# EAGLE design open-lux-L (EAGLE 6.5.0)
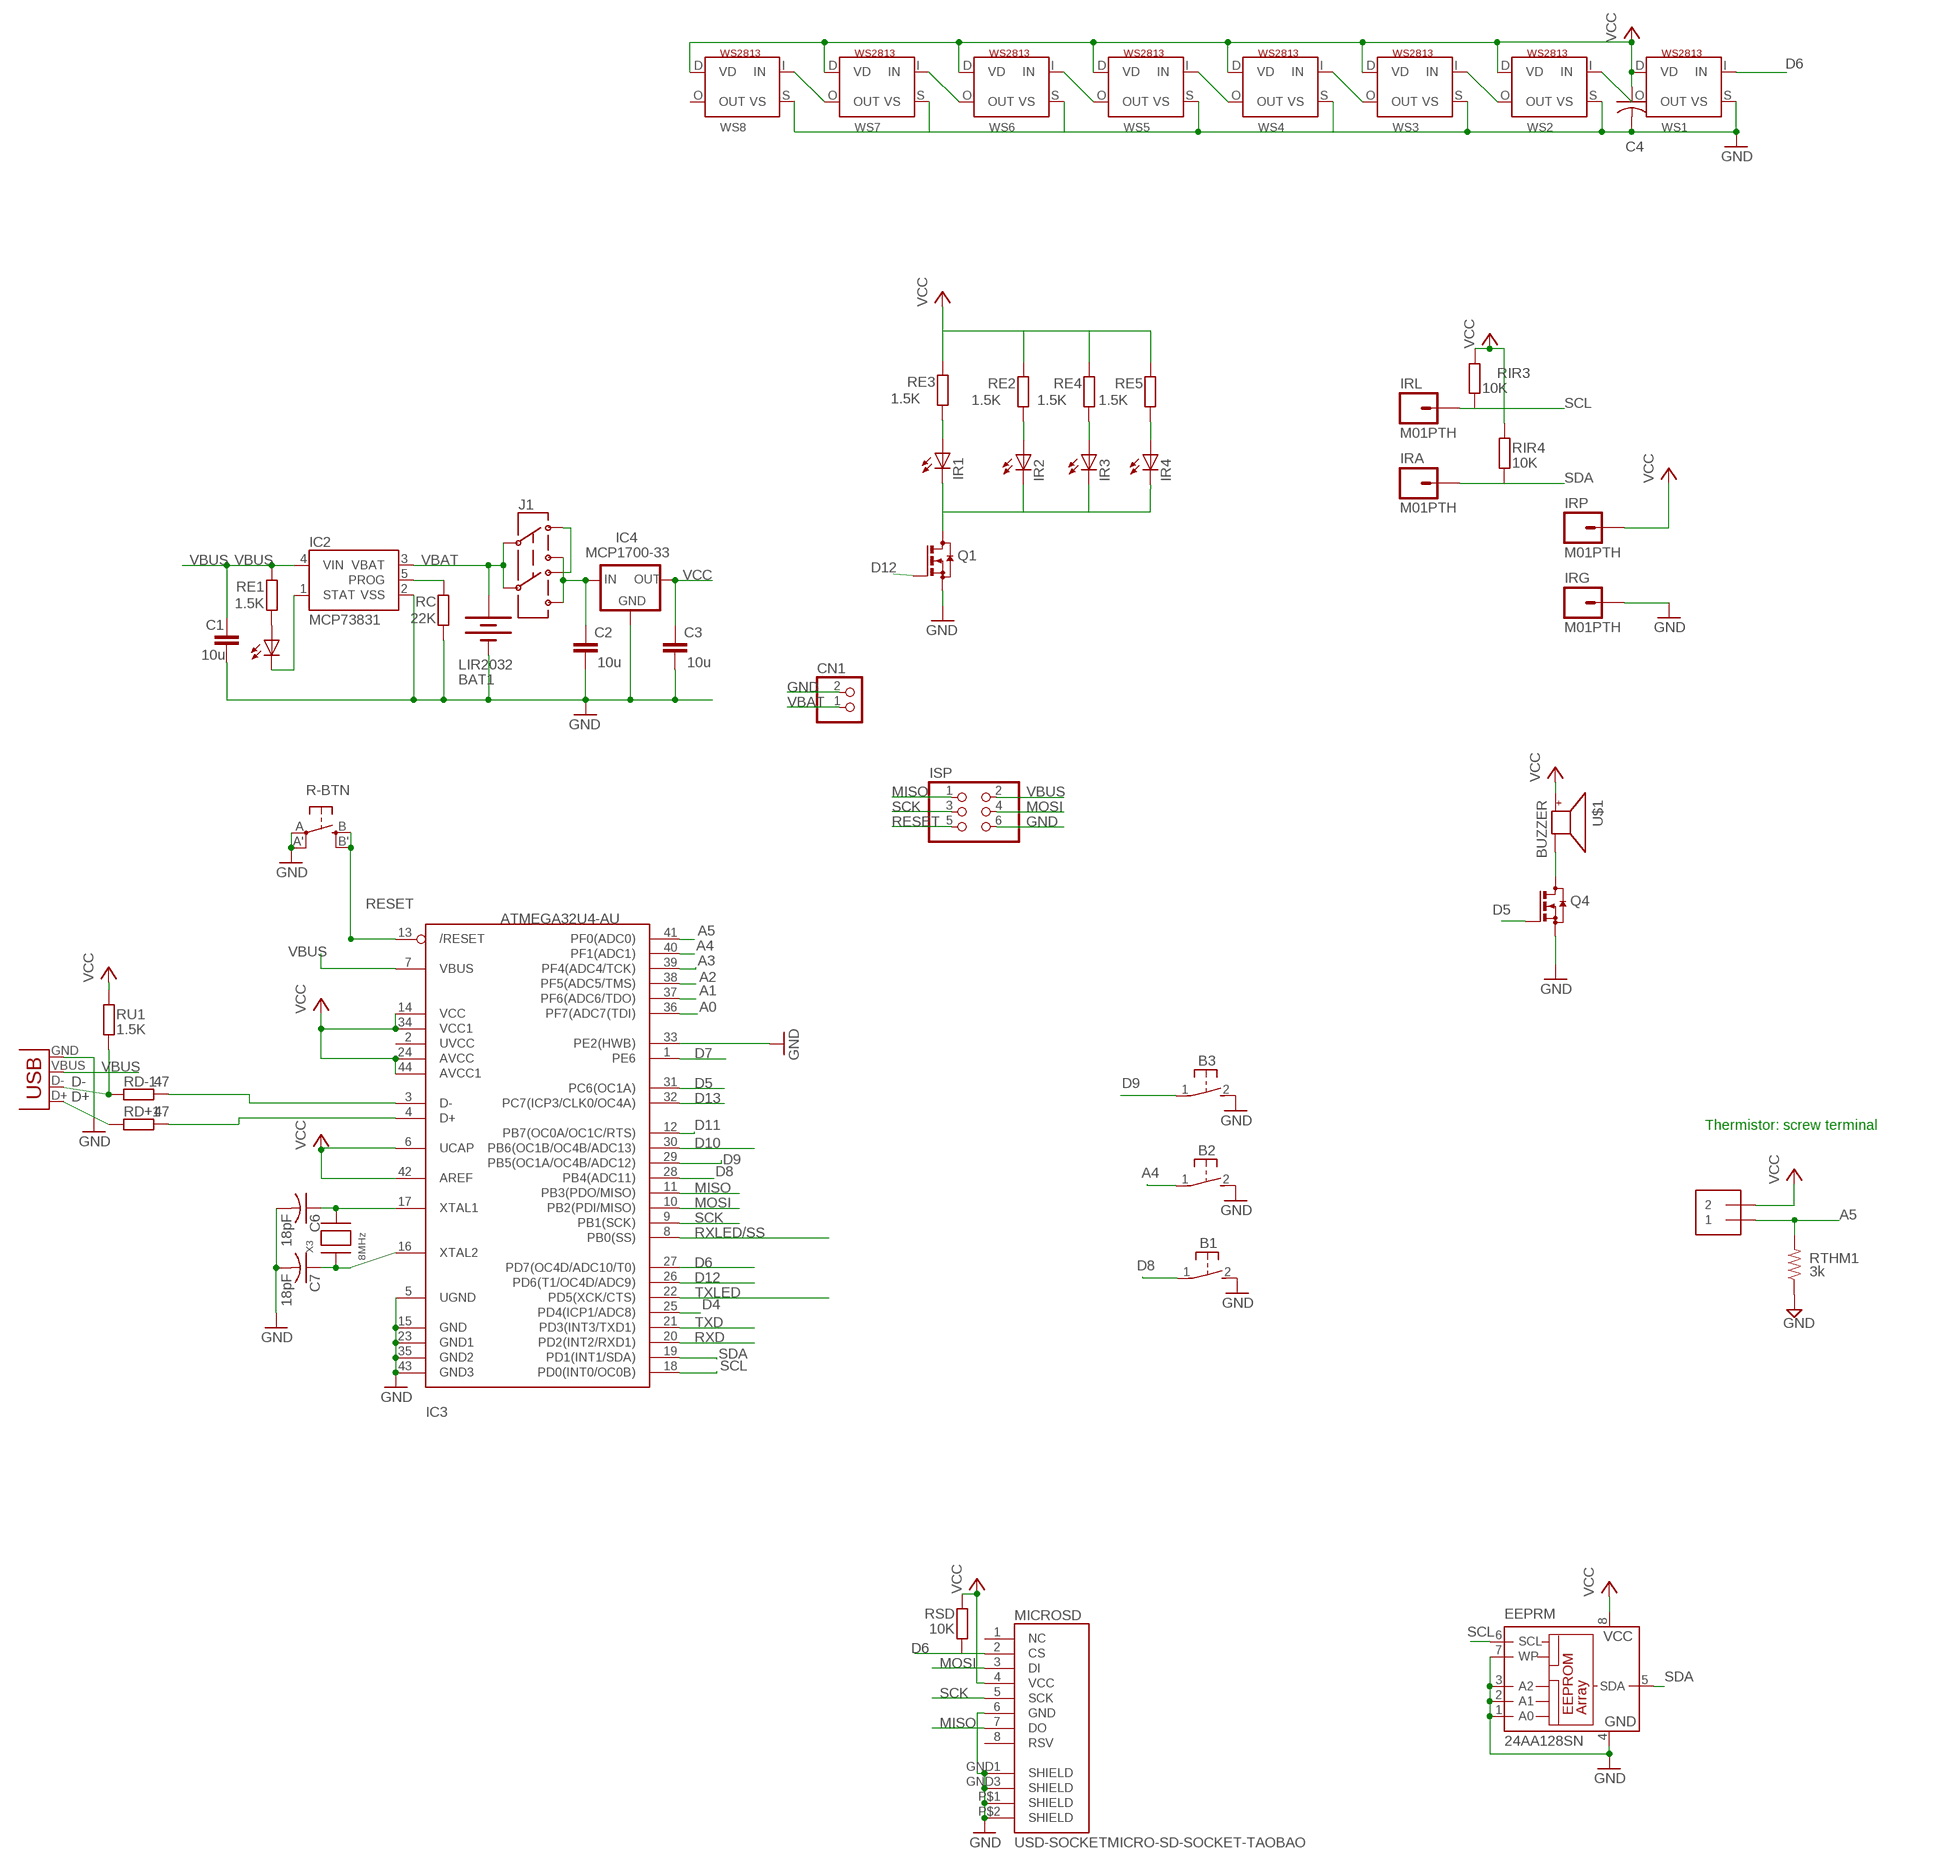
[diagram p0: schematic, sheet 1, part 1 of 2]
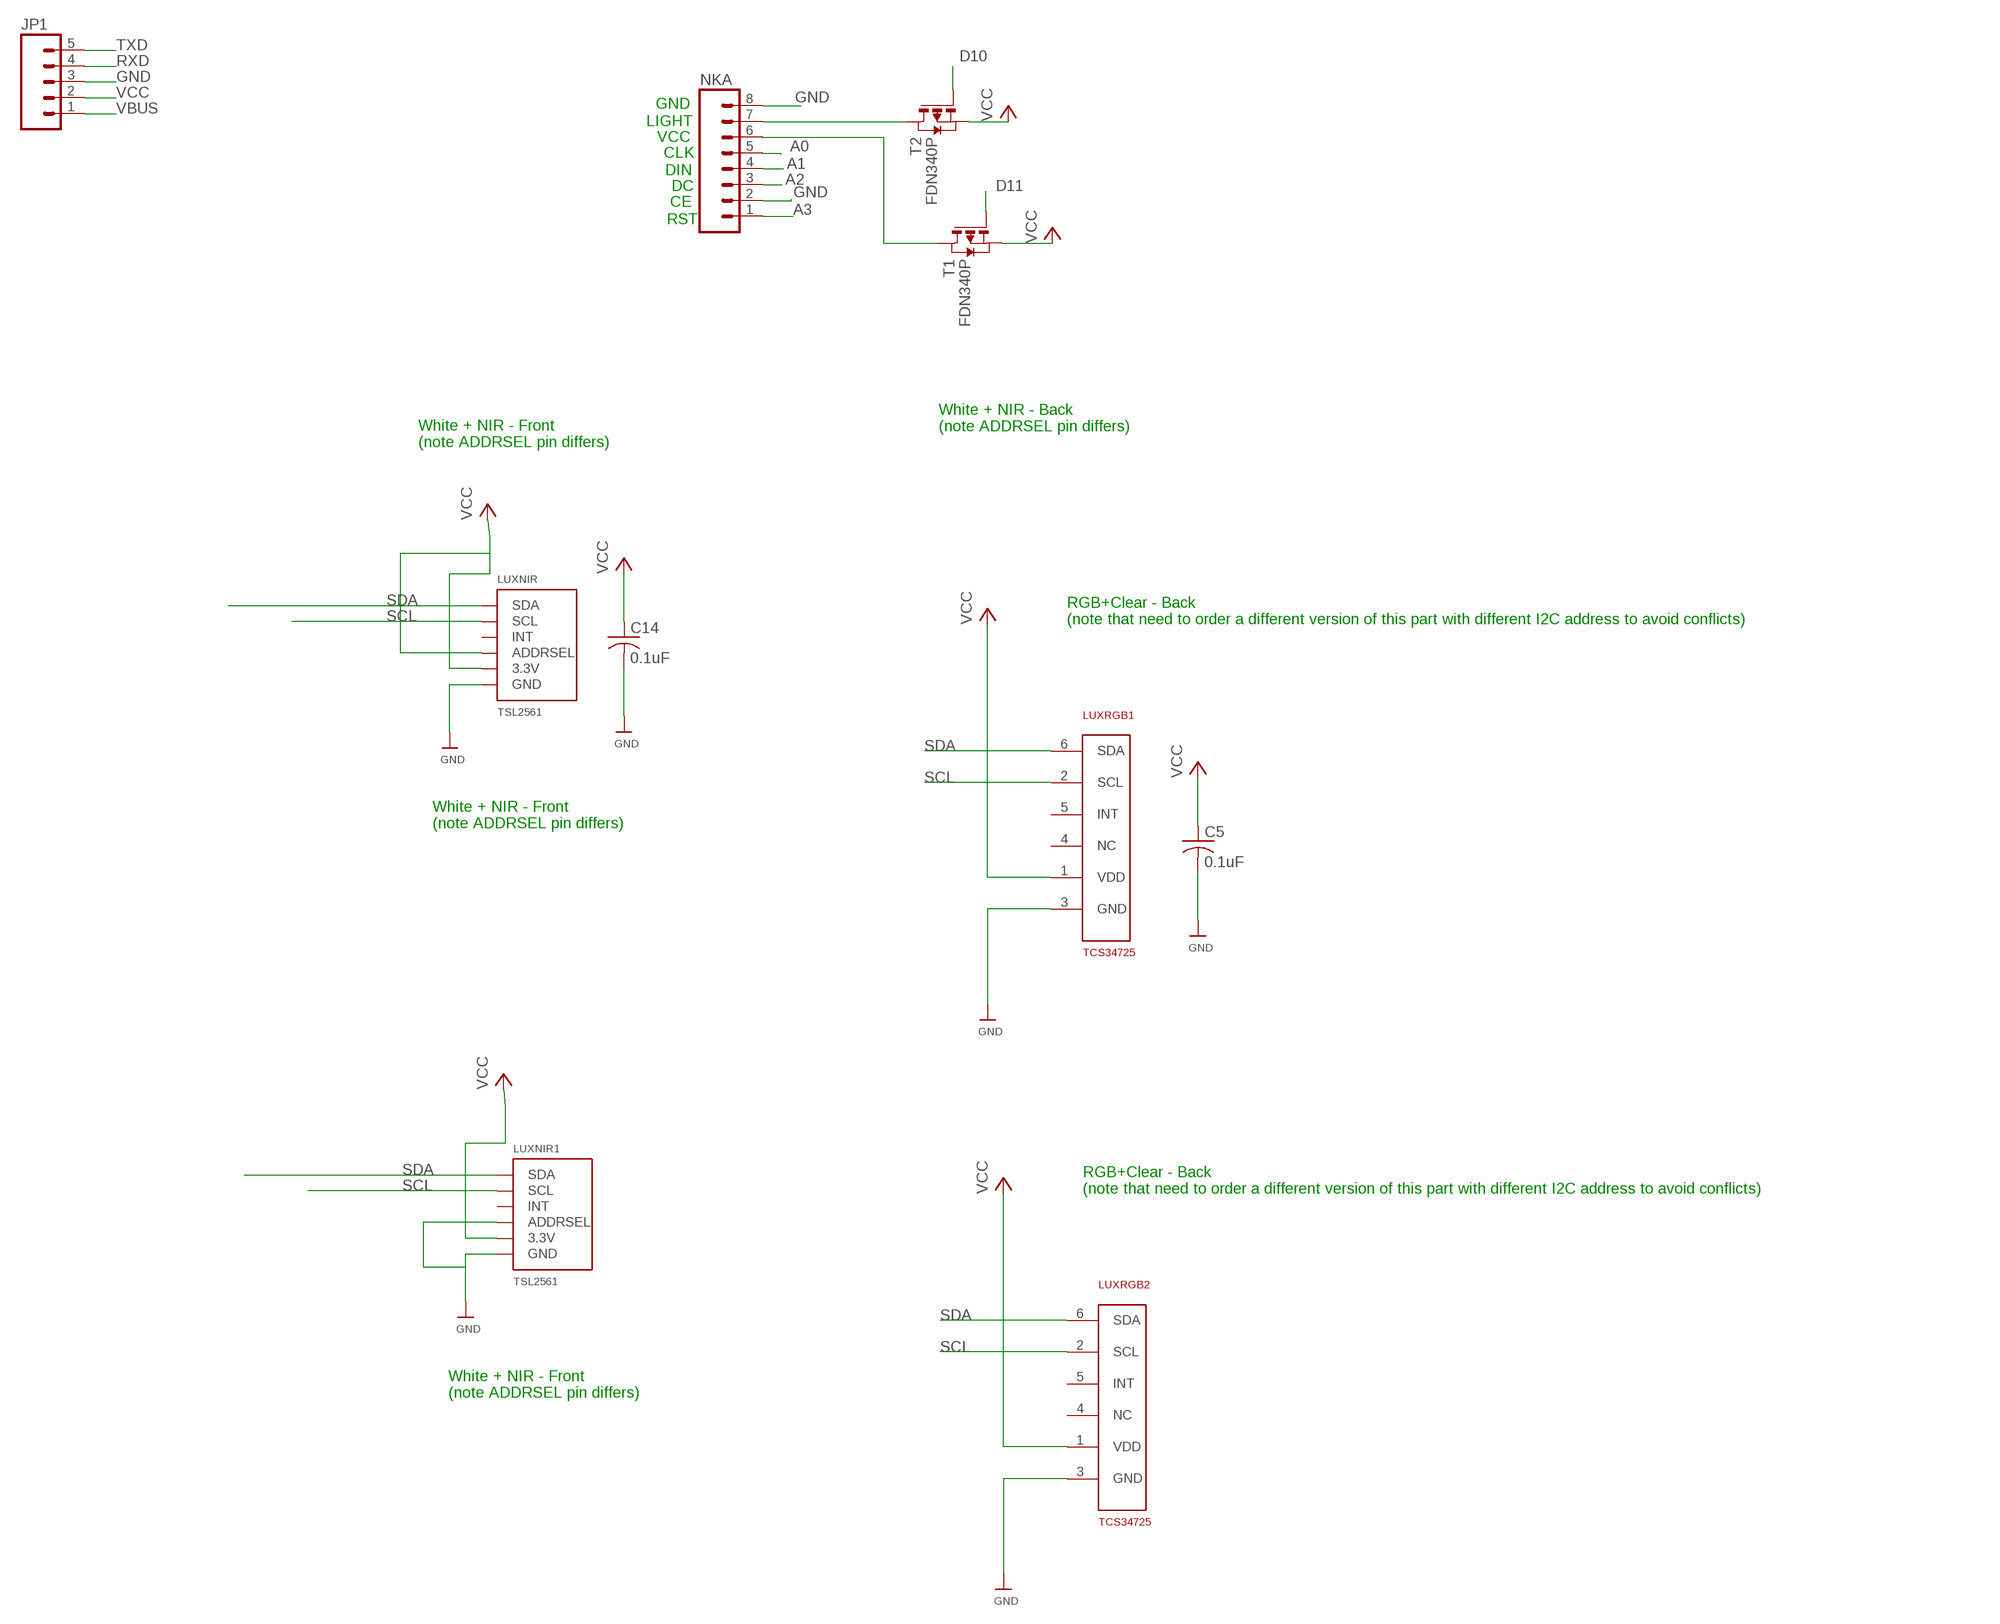
[diagram p1: schematic, sheet 1, part 2 of 2]

## Parts
B1  31-XX  [B3F-31XX]
B2  31-XX  [B3F-31XX]
B3  31-XX  [B3F-31XX]
BAT1  LIR2032  BATTERYBATTCOM_20MM_PTH_SMT  [BATTCOM_20MM_PTH_SMT]
C1  10u  C-EUC0805  [C0805]
C2  10u  C-EUC0805  [C0805]
C3  10u  C-EUC0805  [C0805]
C4  C-USC0805K  [C0805K]
C5  0.1uF  C-USC0805  [C0805]
C6  18pF  C-USC0805K  [C0805K]
C7  18pF  C-USC0805K  [C0805K]
C14  0.1uF  C-USC0805  [C0805]
CHARGE  0805  LEDCHIPLED_0805  [CHIPLED_0805]
CN1  JST_2PIN-SMT-RA  [JST-PH-2-SMT-RA]
EEPRM  24AA128SN  [SO-08]
IC2  MCP73831  [SOT23-5]
IC3  ATMEGA32U4-AU  [TQFP44]
IC4  MCP1700-33  MCP1700SOT233  [SOT23]
IR1  LEDCHIP-LED0603  [CHIP-LED0603]
IR2  LEDCHIP-LED0603  [CHIP-LED0603]
IR3  LEDCHIP-LED0603  [CHIP-LED0603]
IR4  LEDCHIP-LED0603  [CHIP-LED0603]
IRA  M01PTH  [1X01]
IRG  M01PTH  [1X01]
IRL  M01PTH  [1X01]
IRP  M01PTH  [1X01]
ISP  PINHD-2X3  [2X03]
J1  AYZ0202  [AYZ0202]
JP1  M05LOCK  [1X05_LOCK]
LUXNIR  TSL2561  [TSL2561_FN@1]
LUXNIR1  TSL2561  [TSL2561_FN@1]
LUXRGB1  TCS34725  [DFN-6]
LUXRGB2  TCS34725  [DFN-6]
MICROSD  USD-SOCKETMICRO-SD-SOCKET-TAOBAO  [MICRO-SD-SOCKET-TAOBAO]
NKA  M08LOCK  [1X08_LOCK]
Q1  BSS123  [SOT23]
Q4  BSS123  [SOT23]
R-BTN  EVQQ2  [EVQ-Q2]
RC  22K  R-EU_R0805  [R0805]
RD+1  47  R-EU_R0805  [R0805]
RD-1  47  R-EU_R0805  [R0805]
RE1  1.5K  R-EU_R0805  [R0805]
RE2  1.5K  R-EU_R0805  [R0805]
RE3  1.5K  R-EU_R0805  [R0805]
RE4  1.5K  R-EU_R0805  [R0805]
RE5  1.5K  R-EU_R0805  [R0805]
RIR3  10K  R-EU_R0805  [R0805]
RIR4  10K  R-EU_R0805  [R0805]
RSD  10K  R-EU_R0805  [R0805]
RTHM1  3k  R-US_R0805  [R0805@1]
RU1  1.5K  R-EU_R0805  [R0805]
T1  FDN340P  PMOSSOT23  [SOT-23]
T2  FDN340P  PMOSSOT23  [SOT-23]
THM1  1X2-3.5MM  [1X2-3.5MM]
U$1  BUZZER  [SMT-8585-BUZZER]
WS1  WS2813  [RGBLED5050_4]
WS2  WS2813  [RGBLED5050_4]
WS3  WS2813  [RGBLED5050_4]
WS4  WS2813  [RGBLED5050_4]
WS5  WS2813  [RGBLED5050_4]
WS6  WS2813  [RGBLED5050_4]
WS7  WS2813  [RGBLED5050_4]
WS8  WS2813  [RGBLED5050_4]
X2  USBSMD  [USB-MINIB]
X3  8MHz  XTALNX5032  [NX5032]

## Nets
A0: IC3.36(PF7(ADC7(TDI)) NKA.5
A1: IC3.37(PF6(ADC6/TDO)) NKA.4
A2: IC3.38(PF5(ADC5/TMS)) NKA.3
A3: IC3.39(PF4(ADC4/TCK)) NKA.1
A4: B2.1(P) IC3.40(PF1(ADC1))
A5: IC3.41(PF0(ADC0)) RTHM1.2 THM1.1
D4: IC3.25(PD4(ICP1/ADC8))
D5: IC3.31(PC6(OC1A)) Q4.1(G)
D6: IC3.27(PD7(OC4D/ADC10/T0)) MICROSD.2(CS) RSD.1 WS1.I(IN)
D7: IC3.1(PE6)
D8: B1.1(P) IC3.28(PB4(ADC11))
D9: B3.1(P) IC3.29(PB5(OC1A/OC4B/ADC12))
D10: IC3.30(PB6(OC1B/OC4B/ADC13)) T2.3(G)
D11: IC3.12(PB7(OC0A/OC1C/RTS)) T1.3(G)
D12: IC3.26(PD6(T1/OC4D/ADC9)) Q1.1(G)
D13: IC3.32(PC7(ICP3/CLK0/OC4A))
D+: RD+1.1 X2.D+
D-: RD-1.1 RU1.1 X2.D-
GND: B1.2(S) B2.2(S) B3.2(S) BAT1.P$1(-) C1.2 C2.2 C3.2 C4.2 C5.2 C6.2 C7.2 C14.2 CN1.2 EEPRM.1(A0) EEPRM.2(A1) EEPRM.3(A2) EEPRM.4(GND) EEPRM.7(WP) IC2.2(VSS) IC3.5(UGND) IC3.15(GND) IC3.23(GND1) IC3.33(PE2(HWB)) IC3.35(GND2) IC3.43(GND3) IC4.1(GND) IRG.1 ISP.6 JP1.3 LUXNIR1.ADR(ADDRSEL) LUXNIR1.VSS(GND) LUXNIR.VSS(GND) LUXRGB1.3(GND) LUXRGB2.3(GND) MICROSD.6(GND) MICROSD.GND1(SHIELD) MICROSD.GND3(SHIELD) MICROSD.P$1(SHIELD) MICROSD.P$2(SHIELD) NKA.2 NKA.8 Q1.2(S) Q4.2(S) R-BTN.A'(P1) R-BTN.A(P) RC.1 RTHM1.1 WS1.S(VS) WS2.S(VS) WS3.S(VS) WS4.S(VS) X2.GND
GND1: WS6.S(VS)
GND2: WS5.S(VS)
MISO: IC3.11(PB3(PDO/MISO)) ISP.1 MICROSD.7(DO)
MOSI: IC3.10(PB2(PDI/MISO)) ISP.4 MICROSD.3(DI)
N$1: J1.3 J1.6
N$2: C7.1 IC3.16(XTAL2) X3.P$1
N$3: C6.1 IC3.17(XTAL1) X3.P$2
N$4: NKA.7 T2.1(D)
N$5: CHARGE.C IC2.1(STAT)
N$6: IC2.5(PROG) RC.2
N$7: Q4.3(D) U$1.-
N$8: NKA.6 T1.1(D)
N$9: IR1.C IR2.C IR3.C IR4.C Q1.3(D)
N$10: CHARGE.A RE1.1
N$11: IR1.A RE3.1
N$13: IR2.A RE2.1
N$14: WS6.O(OUT) WS7.I(IN)
N$15: IR3.A RE4.1
N$16: WS7.S(VS) WS8.S(VS)
N$17: IR4.A RE5.1
N$19: WS5.I(IN)
N$20: WS5.O(OUT) WS6.I(IN)
N$21: IC3.4(D+) RD+1.2
N$22: IC3.3(D-) RD-1.2
N$23: WS1.O(OUT) WS2.I(IN)
N$24: WS2.O(OUT) WS3.I(IN)
N$25: WS3.O(OUT) WS4.I(IN)
N$28: WS7.O(OUT) WS8.I(IN)
RESET: IC3.13(/RESET) ISP.5 R-BTN.B'(S1) R-BTN.B(S)
RXD: IC3.20(PD2(INT2/RXD1)) JP1.4
RXLED/SS: IC3.8(PB0(SS))
SCK: IC3.9(PB1(SCK)) ISP.3 MICROSD.5(SCK)
SCL: EEPRM.6(SCL) IC3.18(PD0(INT0/OC0B)) IRL.1 LUXNIR1.CLK(SCL) LUXNIR.CLK(SCL) LUXRGB1.2(SCL) LUXRGB2.2(SCL) RIR3.1
SDA: EEPRM.5(SDA) IC3.19(PD1(INT1/SDA)) IRA.1 LUXNIR1.DATA(SDA) LUXNIR.DATA(SDA) LUXRGB1.6(SDA) LUXRGB2.6(SDA) RIR4.1
TXD: IC3.21(PD3(INT3/TXD1)) JP1.5
TXLED: IC3.22(PD5(XCK/CTS))
VBAT: BAT1.P$2(+) CN1.1 IC2.3(VBAT) J1.2 J1.5
VBUS: C1.1 IC2.4(VIN) IC3.7(VBUS) ISP.2 JP1.1 RE1.2 X2.VBUS
VCC: C3.1 C4.1 C5.1 C14.1 EEPRM.8(VCC) IC3.6(UCAP) IC3.14(VCC) IC3.24(AVCC) IC3.34(VCC1) IC3.42(AREF) IC3.44(AVCC1) IC4.2(OUT) IRP.1 JP1.2 LUXNIR1.VDD(3.3V) LUXNIR.ADR(ADDRSEL) LUXNIR.VDD(3.3V) LUXRGB1.1(VDD) LUXRGB2.1(VDD) MICROSD.4(VCC) RE2.2 RE3.2 RE4.2 RE5.2 RIR3.2 RIR4.2 RSD.2 RU1.2 T1.2(S) T2.2(S) THM1.2 U$1.+ WS1.D(VD) WS2.D(VD) WS3.D(VD) WS4.D(VD) WS5.D(VD) WS6.D(VD) WS7.D(VD) WS8.D(VD)
VDD: C2.1 IC4.3(IN) J1.1 J1.4
Unconnected: IC3.2(UVCC) LUXNIR1.INT LUXNIR.INT LUXRGB1.4(NC) LUXRGB1.5(INT) LUXRGB2.4(NC) LUXRGB2.5(INT) MICROSD.1(NC) MICROSD.8(RSV) WS4.O(OUT) WS8.O(OUT)

## Notes on the sheet
- GND
- LIGHT
- VCC
- CLK
- DIN
- DC
- CE
- RST
- White + NIR - Back
  (note ADDRSEL pin differs)
- White + NIR - Front
  (note ADDRSEL pin differs)
- RGB+Clear - Back 
  (note that need to order a different version of this part with different I2C address to avoid conflicts)
- White + NIR - Front
  (note ADDRSEL pin differs)
- Thermistor: screw terminal
- RGB+Clear - Back 
  (note that need to order a different version of this part with different I2C address to avoid conflicts)
- White + NIR - Front
  (note ADDRSEL pin differs)

## Library data of the parts
B1-B3 = adafruit:31-XX: OMRON SWITCH Now with beefier pads!
BAT1 = SparkFunNew:BATTERY: Battery Holders Various common sizes : AA, AAA, 20mm coin cell and 12mm coin cell.
C1-C3 = resistor:C-EU: CAPACITOR, European symbol
C4 = adafruit2013:C-US: CAPACITOR, American symbol
C5-C7 C14 = adafruit:C-US: CAPACITOR, American symbol
CHARGE = led:LED: LED
CN1 = adafruit:JST_2PIN: JST 2-Pin Connectors of various flavors SMT-RA (S2B-PH-SM4) 4UConnector #17311 SMT (B2B-PH-SM4) THM-RA (S2B-PH) THM (B2B-PH)
EEPRM = microchip:24*: Serial EEPROM I2C; MF: MICROCHIP; MPN: 24AA128-I/SN; OC_FARNELL: unknown; OC_NEWARK: 92C6842
IC2 = SparkFunNew:MCP73831: Microchip's MCP73831 Miniature single cell, fully integrated Li-Ion, Li-polymer charge management controller http://ww1.microchip.com/downloads/en/DeviceDoc/21984a.pdf
IC3 = adaprog:ATMEGA32U4
IC4 = adafruit:MCP1700: VOLTAGE REGULATOR
IR1-IR4 = adafruit:LED: LED
IRA IRG IRL IRP = SparkFun-Connectors:M01: Header 1 Standard 1-pin 0.1" header. Use with straight break away headers (SKU : PRT-00116), right angle break away headers (PRT-00553), swiss pins (PRT-00743), machine pins (PRT-00117), and female headers (PRT-00115).
ISP = pinhead:PINHD-2X3: PIN HEADER
J1 = SparkFunNew:AYZ0202: SPDT Slide Switch Simple SMD single-pull double-throw slide switch. Good for less than 350mA power switch, switching UARTs between devices, etc. Spark Fun Electronics SKU : COM-00597
JP1 = SparkFun-Connectors:M05: Header 5 Standard 5-pin 0.1" header. Use with straight break away headers (SKU : PRT-00116), right angle break away headers (PRT-00553), swiss pins (PRT-00743), machine pins (PRT-00117), and female headers (PRT-00115). Molex polarized connector foot print use with SKU : PRT-08230 with associated crimp pins and housings.
LUXNIR LUXNIR1 = microbuilder:TSL2561: TSL2561 Light-To-Digital Sensor Mouser Part Numbers: CS (obsolete): 856-TSL2561CS DFN (cheapest): 856-TSL2561FN
LUXRGB1 LUXRGB2 = dwbLibrary:TCS34725
MICROSD = SparkFunNew:USD-SOCKET: microSD Socket Push-push type uSD socket. Schematic element and footprint production proven. Spark Fun Electronics SKU : PRT-00127. tDoc lines correctly indicate media card edge positions when inserting (unlocked, locked, depressed).
NKA = SparkFun-Connectors:M08: Header 8 Standard 8-pin 0.1" header. Use with straight break away headers (SKU : PRT-00116), right angle break away headers (PRT-00553), swiss pins (PRT-00743), machine pins (PRT-00117), and female headers (PRT-00115).
Q1 Q4 = transistor-small-signal:BSS123: N-CHANNEL MOS FET
R-BTN = adafruit:EVQQ2: SMT 6mm switch, EVQQ2 series http://www.ladyada.net/library/eagle
RC RD+1 RD-1 RE1-RE5 RIR3 RIR4 RSD RU1 = rcl:R-EU_: RESISTOR, European symbol
RTHM1 = rcl:R-US_: RESISTOR, American symbol
T1 T2 = zetex:PMOSSOT23: MOS FET
THM1 = adafruit:1X2: 3.5mm Terminal block http://www.ladyada.net/library/pcb/eaglelibrary.html
U$1 = adafruit:BUZZER
WS1-WS8 = adafruit:WS2813
X2 = SparkFun:USB: USB Connectors USB-B-PTH is fully proven SKU : PRT-00139 USB-miniB is fully proven SKU : PRT-00587 USB-A-PCB is untested. USB-A-H is throughly reviewed, but untested. Spark Fun Electronics SKU : PRT-00437 USB-B-SMT is throughly reviewed, but untested. Needs silkscreen touching up. USB-A-S has not been used/tested USB-MB-H has not been used/tested
X3 = adaprog:XTAL

## Net classes
0 default: width 0.254 mm, clearance 0.254 mm
1 power: width 0.254 mm, clearance 0.203 mm

## Board
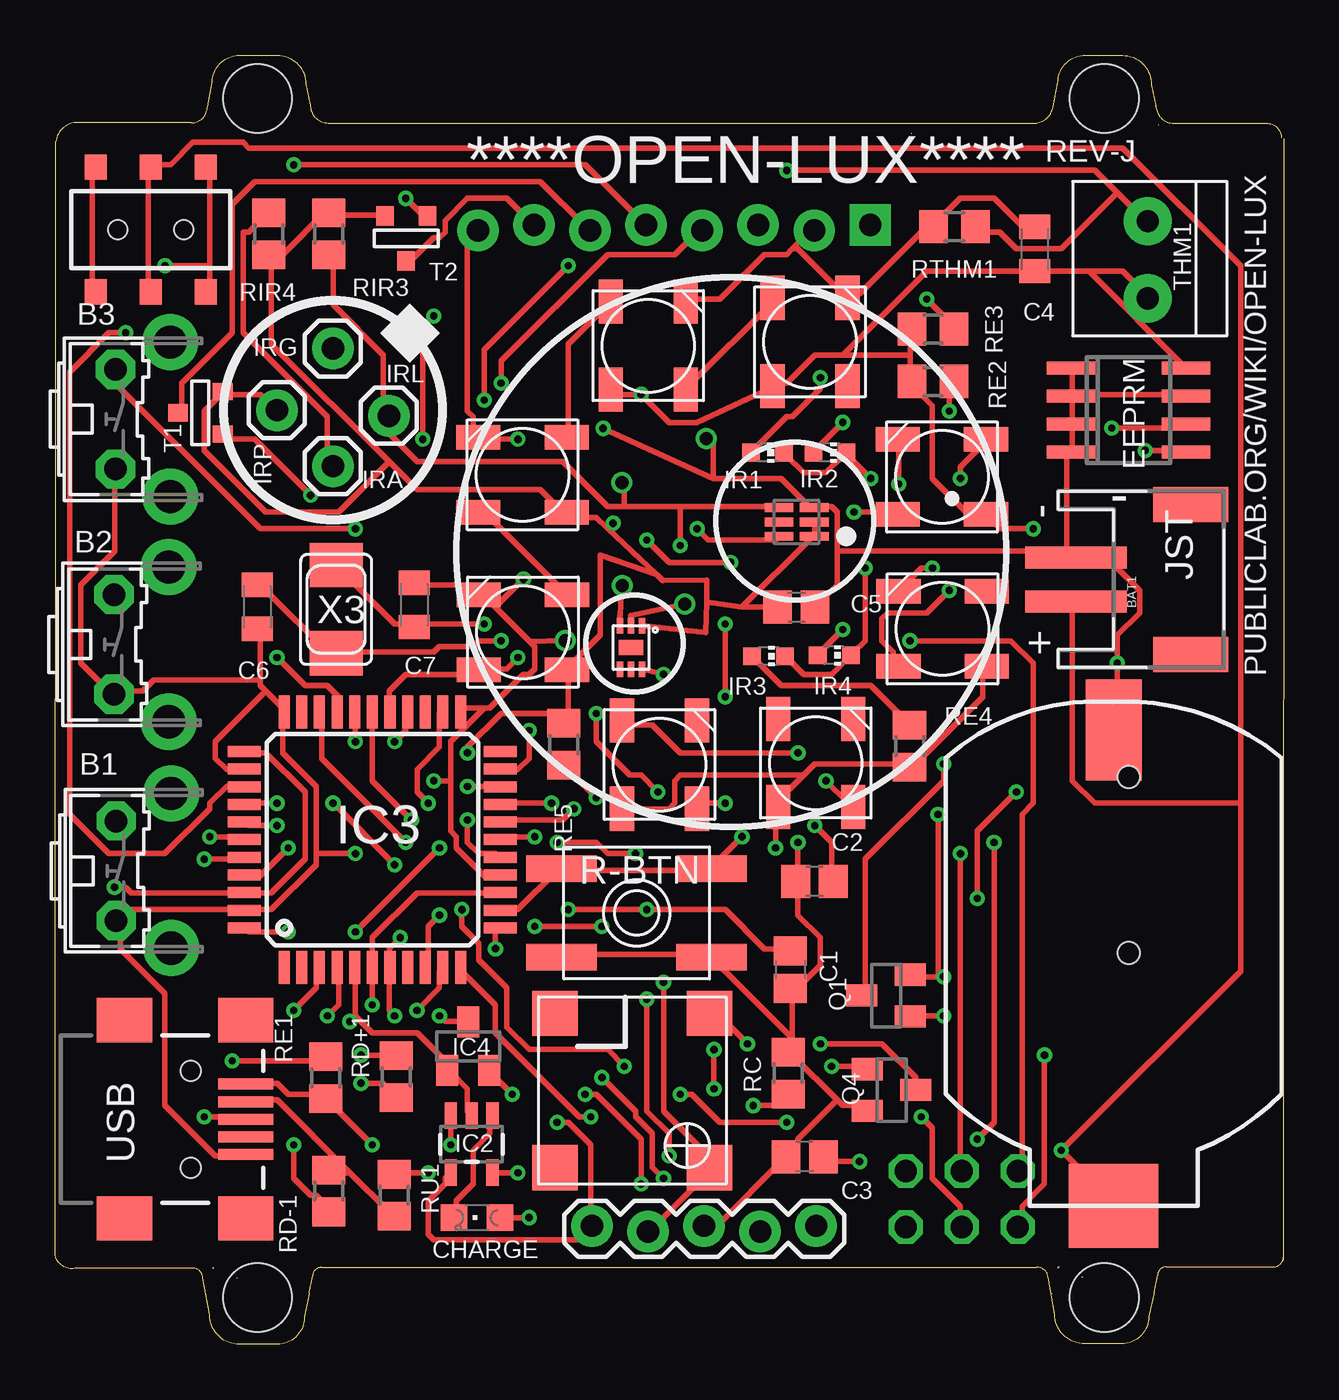
[diagram p2: board, top side]
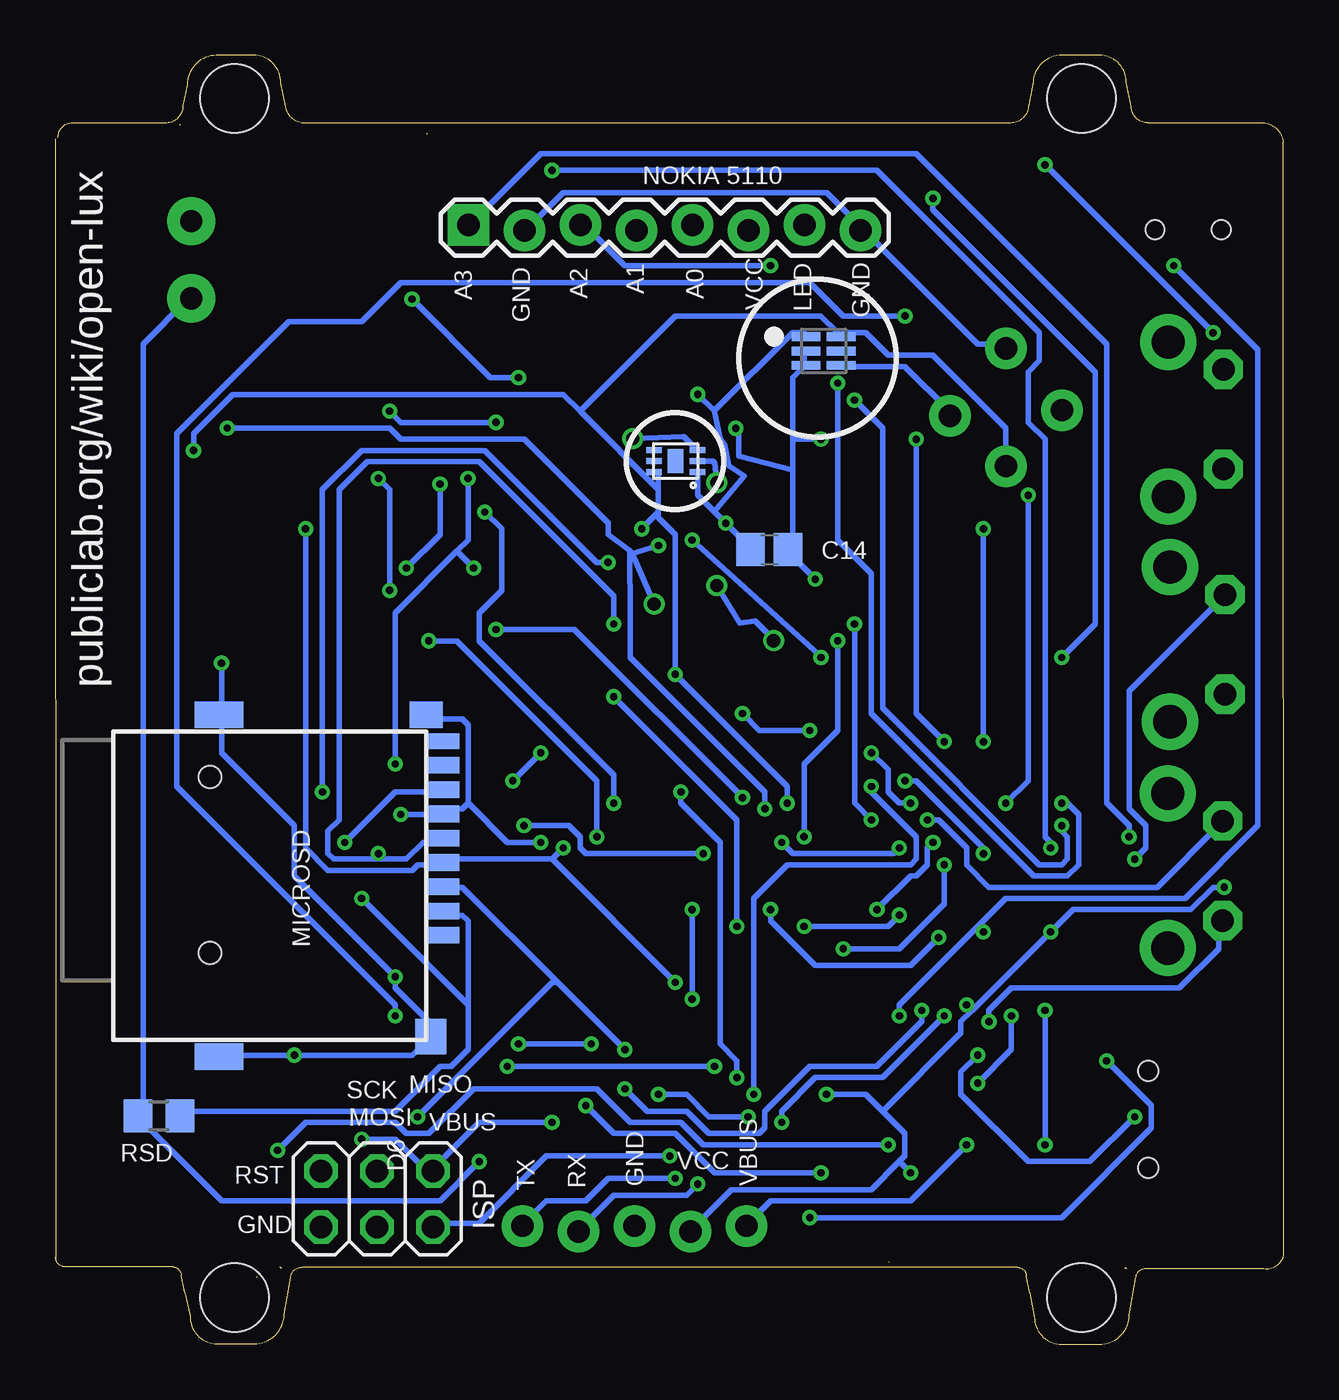
[diagram p3: board, bottom side, seen from below]

Size 55.71 x 58.48 mm. Coordinates in mm from the lower left corner, seen from the top.
Outline: 55.71,54.69 55.68,3.81
Outline: 8.24,3.03 arc-90 8.26,3.01
Outline: 17.89,3.73 arc-90 17.9,3.72
Outline: 38.85,54.92 arc-90 38.84,54.93
Outline: 50.03,55.31 arc90 50.05,55.33
Outline: 44.5,3.49 12.06,3.49 arc90 11.67,3.1
Outline: 44.21,55.4 12.38,55.4 arc-90 11.57,56.21 11.57,56.2 11.37,57.15 arc90 10.06,58.48 8.36,58.48 arc90 7.13,57.24 6.91,56.15 arc-90 6.17,55.41 1.12,55.41 arc90 0.03,54.56 0.03,54.54 0,4.03 arc90 0.97,3.46 6.2,3.46 arc-90 6.7,3.02 7,1.34 arc90 8.37,0 10.07,0 arc90 11.3,1.24 11.52,2.33 11.67,3.11
Outline: 44.21,55.4 44.52,55.4
Outline: 44.21,55.4 arc90 45.25,56.14 45.47,57.23 arc-90 46.7,58.47 48.4,58.47 arc-90 49.71,57.14 49.91,56.19 49.91,56.2 arc90 50.72,55.39 54.94,55.39 arc-90 55.6,54.73
Outline: 6.86,2.28 6.86,2.27
Outline: 7.2,3.48 arc90 7.14,3.42
Outline: 46.56,3.06 arc-90 46.58,3.04
Outline: 45.18,2.31 45.18,2.3
Outline: 49.99,3.14 49.84,2.36 49.59,1.27 arc-90 48.36,0.03 46.69,0.03 arc-90 45.32,1.37 45.02,3.05 arc90 44.52,3.49
Outline: 49.99,3.13 arc-90 50.38,3.52 55.25,3.52 arc90 55.69,3.96
Outline: 45.52,3.51 arc90 45.46,3.45
Copper layers (1*16): Top 0.0356mm / dielectric 1.5011mm / Bottom 0.0356mm
Design rules "LaenPCBOrder": minimum track width 6mil, minimum drill 13mil, track to track 6mil, track to pad 6mil, pad to pad 6mil, via to via 6mil, smd to smd 6mil, copper to edge 15mil, drill to drill 6mil, minimum pad ring 7mil, minimum via ring 7mil, stop-mask expansion 3mil, vias tented up to drill 0mil, thermal gap 10mil
Holes 3.1 mm at 9.17,56.52 47.57,56.52 9.17,2.12 47.57,2.12

### Footprints (pad centres in the part's own frame; a part is rotated, then mirrored left to right if it is on the bottom)
B3F-31XX = drill 1.016 pad 1.778 octagon: 1 -2.261,-1.245; 2 2.261,-1.245 | drill 1.499 pad 2.54: 3 -3.505,1.245; 4 3.505,1.245
BATTCOM_20MM_PTH_SMT = smd 4.572 x 2.54: P$1 0,0 | smd 3.81 x 4.064: P$2 21.59,0
C0805 = smd 1.3 x 1.5: 1 -0.85,0; 2 0.85,0
C0805K = smd 1.1 x 1.4: 1 -1,0; 2 1,0
CHIPLED_0805 = smd 1.2 x 1.2: A 0,-1.05; C 0,1.05
JST-PH-2-SMT-RA = smd 1 x 4.6: 1 1,-3.7; 2 -1,-3.7 | smd 1.6 x 3.4: NC1 -3.4,1.5; NC2 3.4,1.5
SO-08 = smd 0.6 x 2.2: 1 -1.905,-2.6; 2 -0.635,-2.6; 3 0.635,-2.6; 4 1.905,-2.6; 5 1.905,2.6; 6 0.635,2.6; 7 -0.635,2.6; 8 -1.905,2.6
SOT23-5 = smd 0.55 x 1.2: 1 -0.95,-1.3; 2 0,-1.3; 3 0.95,-1.3; 4 0.95,1.3; 5 -0.95,1.3
TQFP44 = smd 1.5 x 0.5: 1 -5.8,4; 2 -5.8,3.2; 3 -5.8,2.4; 4 -5.8,1.6; 5 -5.8,0.8; 6 -5.8,0; 7 -5.8,-0.8; 8 -5.8,-1.6; 9 -5.8,-2.4; 10 -5.8,-3.2; 11 -5.8,-4; 23 5.8,-4; 24 5.8,-3.2; 25 5.8,-2.4; 26 5.8,-1.6; 27 5.8,-0.8; 28 5.8,0; 29 5.8,0.8; 30 5.8,1.6; 31 5.8,2.4; 32 5.8,3.2; 33 5.8,4 | smd 0.5 x 1.5: 12 -4,-5.8; 13 -3.2,-5.8; 14 -2.4,-5.8; 15 -1.6,-5.8; 16 -0.8,-5.8; 17 0,-5.8; 18 0.8,-5.8; 19 1.6,-5.8; 20 2.4,-5.8; 21 3.2,-5.8; 22 4,-5.8; 34 4,5.8; 35 3.2,5.8; 36 2.4,5.8; 37 1.6,5.8; 38 0.8,5.8; 39 0,5.8; 40 -0.8,5.8; 41 -1.6,5.8; 42 -2.4,5.8; 43 -3.2,5.8; 44 -4,5.8
SOT23 = smd 1 x 1.4: 1 -0.95,-1.1; 2 0.95,-1.1; 3 0,1.1
CHIP-LED0603 = smd 0.8 x 0.8: A 0,-0.75; C 0,0.75
1X01 = drill 1.016 pad 1.88: 1 0,0
2X03 = drill 1.016 octagon: 1 -2.54,-1.27; 2 -2.54,1.27; 3 0,-1.27; 4 0,1.27; 5 2.54,-1.27; 6 2.54,1.27
AYZ0202 = smd 1 x 1.15: 1 -2.5,2.825; 2 0,2.825; 3 2.5,2.825; 4 -2.5,-2.825; 5 0,-2.825; 6 2.5,-2.825 | hole 0.85: 1.5,0; -1.5,0
1X05_LOCK = drill 1.016 pad 1.88: 1 0,0.127; 2 2.54,-0.127; 3 5.08,0.127; 4 7.62,-0.127; 5 10.16,0.127
TSL2561_FN@1 = smd 1.3 x 0.4: ADR -0.8,0; CLK 0.8,-0.65; DATA 0.8,0.65; INT 0.8,0; VDD -0.8,0.65; VSS -0.8,-0.65
DFN-6 = smd 0.28 x 0.7: 1 -0.5,-0.988; 2 0,-0.988; 3 0.5,-0.988; 4 0.5,0.988; 5 0,0.988; 6 -0.5,0.988 | smd 1.1 x 0.7: P$1 0,0
MICRO-SD-SOCKET-TAOBAO = smd 0.75 x 1.6: 1 2.25,10.5; 2 1.15,10.5; 3 0.05,10.5; 4 -1.05,10.5; 5 -2.15,10.5; 6 -3.25,10.5; 7 -4.35,10.5; 8 -5.45,10.5 | smd 0.7 x 1.6: CD -6.55,10.5 | smd 1.2 x 1.5: GND1 -7.75,9.8 | smd 1.6 x 1.4: GND3 6.85,10 | smd 1.2 x 2.2: P$1 7.75,0.4; P$2 -7.75,0.4 | hole 1: 3.05,0; -4.93,0
1X08_LOCK = drill 1.016 pad 1.88 square: 1 0,0.127 | drill 1.016 pad 1.88: 2 2.54,-0.127; 3 5.08,0.127; 4 7.62,-0.127; 5 10.16,0.127; 6 12.7,-0.127; 7 15.24,0.127; 8 17.78,-0.127
EVQ-Q2 = smd 3.2 x 1.2: A -3.4,-2; A' 3.4,-2; B -3.4,2; B' 3.4,2
R0805 = smd 1.3 x 1.5: 1 -0.95,0; 2 0.95,0
R0805@1 = smd 1.3 x 1.5: 1 -0.95,0; 2 0.95,0
SOT-23 = smd 0.787 x 0.889: 1 0.025,-1.016; 2 -0.94,1.016; 3 0.991,1.016
1X2-3.5MM = drill 1 pad 2.184: 1 1.8,0; 2 -1.7,0
SMT-8585-BUZZER = smd 2.05 x 2.05: + -3.5,-3.5; - 3.5,-3.5; NC1 -3.5,3.5; NC2 3.5,3.5
RGBLED5050_4 = smd 2 x 1.1: D -2,1.7; I 2,1.7; O -2,-1.7; S 2,-1.7
USB-MINIB = smd 2.5 x 0.5: D+ 2.5,0; D- 2.5,0.8; GND 2.5,-1.6; ID 2.5,-0.8; VBUS 2.5,1.6 | smd 2.5 x 2: GND@1 -3,-4.5; GND@2 -3,4.5; GND@3 2.5,4.5; GND@4 2.5,-4.5 | hole 0.9: 0,2.2; 0,-2.2
NX5032 = smd 2 x 2.4: P$1 2,0; P$2 -2,0

### Placement (x,y rotation side)
B1  4.01,21.48 270 top
B2  3.91,31.75 270 top
B3  3.98,41.97 270 top
BAT1  48,27.87 270 top
C1  33.34,17 270 top
C2  34.43,21 180 top
C3  33.99,8.52 180 top
C4  44.42,49.68 90 top
C5  33.61,33.44 0 top
C6  9.17,33.46 270 top
C7  16.29,33.54 90 top
C14  23.33,36.05 0 bottom
CHARGE  19.13,5.75 90 top
CN1  49.99,34.7 270 top
EEPRM  48.67,42.38 270 top
IC2  18.88,9.08 180 top
IC3  14.38,22.89 90 top
IC4  18.73,13.52 0 top
IR1  32.3,40.45 270 top
IR2  35.14,40.45 270 top
IR3  32.34,31.22 270 top
IR4  35.33,31.25 270 top
IRA  12.59,39.84 270 top
IRG  12.59,45.17 270 top
IRL  15.13,42.12 270 top
IRP  10.05,42.38 270 top
ISP  41.11,6.6 180 bottom
J1  4.33,50.57 180 top
JP1  24.35,5.25 0 top
LUXNIR  33.62,37.3 180 top
LUXNIR1  20.86,45.06 0 bottom
LUXRGB1  26.11,31.61 180 top
LUXRGB2  27.57,40.07 90 bottom
MICROSD  48.68,20.81 270 bottom
NKA  36.96,50.66 0 bottom
Q1  37.68,15.82 90 top
Q4  37.93,11.54 270 top
R-BTN  26.37,19.57 0 top
RC  33.24,12.3 270 top
RD+1  15.46,12.14 270 top
RD-1  12.41,6.96 270 top
RE1  12.28,12.1 270 top
RE2  39.8,43.68 180 top
RE3  39.81,46.05 180 top
RE4  38.74,27.13 270 top
RE5  23.07,27.22 90 top
RIR3  12.4,50.37 90 top
RIR4  9.69,50.37 270 top
RSD  51,10.36 180 bottom
RTHM1  40.78,50.71 0 top
RU1  15.38,6.76 90 top
T1  6.58,42.28 270 top
T2  15.89,50.17 0 top
THM1  49.54,49.15 90 top
U$1  26.17,11.52 90 top
WS1  21.21,32.31 180 top
WS2  21.19,39.44 180 top
WS3  26.89,45.3 90 top
WS4  34.23,45.47 90 top
WS5  34.49,26.37 90 top
WS6  27.4,26.3 90 top
WS7  40.21,39.35 180 top
WS8  40.24,32.45 180 top
X2  6.15,10.21 0 top
X3  12.74,33.35 90 top

### Tracks (layer width: path | path; a pad name or v marks a point on that pad's centre or on a via)
A0  (via drill 0.33)
  Top 0.254: v3.2,45.88 2.44,45.88 0.66,44.11 0.66,24.04 2.44,22.26 4.98,22.26 7.01,24.29 7.01,24.55 7.77,25.31 8.54,25.31 IC3.36 | v10.82,53.5 24.03,53.5 26.57,50.96 NKA.5
  Bottom 0.254: v10.82,53.5 v3.2,45.88
A1  (via drill 0.33)
  Top 0.254: v10.06,24.55 8.79,24.55 IC3.37 | v20.22,43.6 20.22,44.61 25.05,49.44 28.09,49.44 29.11,50.46 NKA.4
  Bottom 0.254: v10.06,24.55 9.81,24.55 9.3,24.04 9.3,21.75 9.81,21.25 11.33,21.25 18.7,28.61 18.7,34.96 20.22,36.49 v20.22,43.6
A2  (via drill 0.33)
  Top 0.254: v10.06,23.53 8.79,23.53 IC3.38 | v19.46,42.84 19.46,45.12 v23.27,48.93
  Bottom 0.254: v10.06,23.53 10.06,23.28 9.81,23.02 9.81,22.01 10.06,21.75 11.08,21.75 18.19,28.87 18.19,41.57 v19.46,42.84 | v23.27,48.93 29.87,48.93 31.65,50.71 NKA.3
A3  (via drill 0.33)
  Top 0.254: v7.01,23.02 8.54,23.02 IC3.39
  Bottom 0.254: v7.01,23.02 7.01,23.53 8.03,24.55 8.03,45.38 16.66,54.01 33.68,54.01 36.73,50.96 NKA.1
A4  (via drill 0.33)
  Top 0.254: v6.76,22.01 8.54,22.01 IC3.40
  Bottom 0.254: v6.76,22.01 6.25,22.52 6.25,23.53 7.01,24.29 7.01,29.63 2.69,33.95 B2.1
A5  (via drill 0.33)
  Top 0.254: v10.57,22.52 9.3,21.25 8.79,21.25 IC3.41 | v33.17,53.25 47.14,53.25 48.16,52.23 | 48.16,52.23 49.43,50.96 THM1.1 | 48.16,52.23 45.62,49.69 43.59,49.69 42.83,50.46 41.81,50.46 RTHM1.2
  Bottom 0.254: v10.57,22.52 10.57,22.77 10.82,23.02 10.82,41.06 11.58,41.82 11.58,44.11 11.08,44.61 11.08,45.88 18.44,53.25 v33.17,53.25
D5  (via drill 0.33)
  Top 0.254: v35.21,12.61 36.73,12.61 Q4.1 | v25.81,12.61 25.05,13.37 21.49,13.37 20.47,14.39 20.47,16.17 19.2,17.44 19.2,18.2 18.44,18.96 v18.44,19.72 | v15.9,22.77 12.09,26.58 12.09,28.61 IC3.31
  Bottom 0.254: v25.81,12.61 v35.21,12.61 | v18.44,19.72 16.92,21.25 16.66,21.25 16.16,21.75 16.16,22.52 v15.9,22.77
D6  (via drill 0.33)
  Top 0.254: IC3.27 15.14,28.87 15.14,29.63 15.9,30.39 19.2,30.39 WS1.I 19.46,30.64 20.47,30.64 v20.98,31.15 | v26.82,36.49 27.84,35.47 v30.63,35.47 | v43.59,25.06 41.81,23.28 v41.81,20.23
  Bottom 0.254: 36.98,15.4 36.98,19.21 37.24,19.47 38,19.47 MICROSD.2 | 36.98,15.4 36.98,13.37 37.75,12.61 38.25,12.61 40.29,10.58 49.94,10.58 RSD.1 | v20.98,31.15 21.3,31.5 v26.82,36.49 | v30.63,35.47 31.14,35.47 36.22,40.55 41.81,40.55 43.59,38.77 v43.59,25.06 | 36.98,15.4 v41.81,20.23
D8  (via drill 0.33)
  Top 0.254: v16.16,23.79 14.38,25.56 14.38,28.61 IC3.28
  Bottom 0.254: v16.16,23.79 15.65,23.79 14.38,22.52 14.38,21.75 13.36,20.74 5.74,20.74 2.95,23.53 B1.1
D9  (via drill 0.33)
  Top 0.254: v13.62,27.34 13.62,28.61 IC3.29 | v13.62,36.99 9.3,36.99 2.95,43.34 2.95,44.11 B3.1
  Bottom 0.254: v13.62,36.99 v13.62,27.34
D10  (via drill 0.33)
  Top 0.254: v15.9,51.98 16.66,51.22 T2.3 | v10.06,31.15 11.33,29.88 12.35,29.88 12.85,29.37 12.85,28.87 IC3.30
  Bottom 0.254: v15.9,51.98 15.9,51.47 8.54,44.11 8.54,32.68 v10.06,31.15
D11  (via drill 0.33)
  Top 0.254: v11.58,38.52 9.04,41.06 7.77,41.06 T1.3 | v15.39,21.75 v12.6,24.55 | v19.97,17.94 19.97,18.71 IC3.12
  Bottom 0.254: v11.58,38.52 11.58,25.56 v12.6,24.55 | v15.39,21.75 15.39,19.98 17.43,17.94 v19.97,17.94
D12  (via drill 0.33)
  Top 0.254: v40.29,14.9 39.02,14.9 Q1.1 | v17.17,46.65 16.66,46.14 v16.66,41.06 | v15.39,27.34 15.9,27.85 15.9,28.61 IC3.26
  Bottom 0.254: v40.29,14.9 40.29,15.4 50.19,25.31 50.19,41.31 45.11,46.39 41.81,46.39 40.03,48.17 21.49,48.17 19.97,46.65 v17.17,46.65 | v16.66,41.06 16.66,28.61 v15.39,27.34
D+  (via drill 0.33)
  Top 0.254: v13.87,13.12 15.39,13.12 RD+1.1 | v6.76,10.32 8.54,10.32 X2.D+
  Bottom 0.254: v13.87,13.12 14.63,12.36 14.63,11.34 11.58,8.29 8.79,8.29 v6.76,10.32
D-
  Top 0.254: 13.36,7.78 12.6,7.78 RD-1.1 | 13.36,7.78 15.14,6.01 RU1.1 | 13.36,7.78 10.06,11.09 8.79,11.09 X2.D-
GND  (via drill 0.33, 0.6 pad 0.25)
  Top 0.254: R-BTN.A 23.01,17.69 29.62,17.69 R-BTN.A' 29.87,17.44 33.43,13.88 | JP1.3 29.62,5.5 30.13,5.5 32.92,8.29 C3.2 33.17,8.55 33.68,9.05 33.68,9.31 35.46,11.09 | 35.46,11.09 33.43,13.12 RC.1 | 35.46,11.09 35.71,10.83 36.73,10.83 Q4.2 | 33.43,13.88 33.43,13.37 RC.1 | 33.43,13.88 33.43,15.91 | 33.43,15.91 34.7,17.18 34.7,18.45 33.68,19.47 33.68,20.99 C2.2 33.68,21.25 v33.68,22.77 | 33.43,15.91 C1.2 | 33.43,13.88 RC.1 | 40.03,16.67 39.02,16.67 Q1.2 | v44.86,13.12 44.86,7.28 43.84,6.26 43.84,5.5 ISP.6 | 46.13,43.09 46.13,44.11 EEPRM.1 | 46.13,43.09 51.21,43.09 EEPRM.7 | 46.13,43.09 EEPRM.2 46.13,42.84 46.13,41.82 EEPRM.3 46.13,41.57 46.13,40.55 EEPRM.4 45.87,40.3 45.87,35.98 | 35.46,35.98 35.46,34.45 34.7,33.69 C5.2 | 35.46,35.98 35.46,37.76 35.21,38.01 34.44,38.01 LUXNIR.VSS 34.19,38.01 32.92,39.28 29.83,39.28 | 45.87,35.98 35.46,35.98 | 45.87,35.98 46.13,35.72 CN1.2 | BAT1.P$1 48.16,28.1 v48.16,30.9 48.16,32.17 49.18,33.18 49.18,34.2 47.91,35.47 46.38,35.47 CN1.2 | 45.87,35.98 CN1.2 | 40.03,16.67 v40.03,24.04 | 40.03,16.67 v40.29,16.67 | 9.3,30.14 9.3,29.88 9.55,29.63 | 9.3,30.14 9.3,32.42 C6.2 | 9.55,29.63 10.31,28.87 IC3.33 10.31,28.61 10.31,26.83 11.84,25.31 11.84,22.26 | 9.55,29.63 7.27,27.34 7.27,26.58 7.77,26.07 8.54,26.07 IC3.35 | 9.3,30.14 4.47,30.14 3.96,29.63 2.69,29.63 B2.2 2.44,29.63 1.17,30.9 1.17,34.45 2.69,35.98 2.69,39.53 B3.2 | IC2.2 18.7,10.58 18.7,11.59 17.93,12.36 IC4.1 17.93,12.61 16.41,14.13 14.38,14.13 13.62,14.9 | 13.62,14.9 13.62,16.93 IC3.5 | X2.GND 8.54,8.55 7.27,8.55 4.98,10.83 4.98,15.91 2.95,17.94 2.95,19.21 B1.2 2.95,19.47 3.2,19.72 8.54,19.72 IC3.43 8.79,19.72 9.81,19.72 11.84,21.75 11.84,22.26
  Top 0.254: v13.36,14.64 13.62,14.9 | C4.2 44.35,50.71 43.84,50.71 42.57,51.98 41.05,51.98 39.78,50.71 RTHM1.1 39.78,50.46 39.27,50.46 36.48,47.66 35.97,47.66 WS4.S 35.71,47.66 33.68,49.69 33.43,49.69 | 33.43,49.69 34.19,50.46 NKA.2 | 33.43,49.69 33.17,49.44 32.16,49.44 30.13,47.41 28.6,47.41 WS3.S | C7.2 16.41,34.45 18.95,34.45 19.2,34.2 WS1.S 19.46,33.95 19.97,33.44 | 19.46,28.87 19.71,28.87 21.24,30.39 21.49,30.39 21.74,30.64 21.74,31.66 21.51,31.89 | 19.46,28.87 18.44,28.87 IC3.23 | 19.97,33.44 21.51,31.89 | 17.93,25.56 17.93,27.34 19.46,28.87 | 17.93,25.56 17.93,23.28 18.19,23.02 18.19,22.52 19.46,21.25 19.97,21.25 IC3.15 | NKA.8 18.95,50.46 18.7,50.2 18.7,42.33 18.95,42.07 18.95,41.31 WS2.S 19.2,41.06 v20.98,41.06 | v21.24,34.71 19.97,33.44 | v13.62,22.26 11.84,22.26 | 17.93,25.56 v17.17,25.56 | v24.85,41.55 29.83,39.28 | v29.52,41.09 29.83,40.87 29.83,39.28 | LUXRGB1.3 25.61,33.07 25.62,33.08 25.66,34 25.66,34.23 v25.71,34.42 | v23.13,31.92 23.03,31.92 21.51,31.89
  Bottom 0.254: 36.98,24.55 36.98,28.1 37.24,28.36 38.76,28.36 MICROSD.GND1 | 36.98,24.55 37.24,24.29 38,24.29 MICROSD.6 38.25,24.04 v40.03,24.04 | 36.98,24.55 35.21,22.77 v33.68,22.77 | MICROSD.P$1 48.16,13.12 v44.86,13.12 39.52,13.12 38.76,13.88 MICROSD.GND3 38.76,14.13 38.76,14.64 40.29,16.17 v40.29,16.67 44.86,21.25 44.86,23.53 48.16,26.83 48.16,28.36 MICROSD.P$2 48.16,28.61 v48.16,30.9 | v13.36,14.64 13.36,15.15 12.35,16.17 4.73,16.17 2.95,17.94 2.95,19.21 B1.2 | 21.74,44.36 21.74,44.87 LUXNIR1.ADR | 22.25,41.06 22.25,43.85 21.74,44.36 | 22.25,41.06 22.25,39.66 | 22.25,39.66 22.25,36.23 C14.2 22.51,35.98 v21.24,34.71 | 21.74,44.36 LUXNIR1.VSS | IRG.1 12.6,45.38 13.87,45.38 18.95,50.46 NKA.8 19.2,50.71 20.73,52.23 32.67,52.23 34.19,50.71 NKA.2 | v20.98,41.06 22.25,41.06 | v13.62,22.26 13.62,22.52 16.66,25.56 v17.17,25.56 | 22.25,39.66 24.71,40.29 24.71,41.47 v24.85,41.55 | LUXRGB2.3 27.19,41.18 v29.52,41.09 | v25.71,34.42 24.67,32.72 23.95,32.8 23.17,32.02 v23.13,31.92
MISO  (via drill 0.33)
  Top 0.254: v24.28,10.32 23.78,10.32 19.97,14.13 19.97,15.4 18.44,16.93 IC3.11 | v28.35,11.34 28.86,11.34 30.13,10.07 v33.17,10.07 | v42.57,22.77 42.57,10.07 v41.81,9.31
  Bottom 0.254: v24.28,10.32 26.06,10.32 27.08,11.34 v28.35,11.34 | v33.17,10.07 36.48,10.07 38.51,8.04 ISP.1 38.76,7.78 40.29,9.31 v41.81,9.31 | v42.57,22.77 40.29,25.06 38.25,25.06 MICROSD.7
MOSI  (via drill 0.33)
  Top 0.254: v16.41,15.15 17.43,16.17 17.43,16.93 IC3.10 | v29.87,13.37 v29.87,11.59 | v39.27,10.32 39.78,9.82 39.78,7.53 41.05,6.26 41.05,5.5 ISP.4
  Bottom 0.254: v16.41,15.15 16.41,14.64 18.44,12.61 21.49,12.61 23.52,10.58 23.52,9.82 23.78,9.56 26.06,9.56 27.08,10.58 28.86,10.58 v29.87,11.59 | 32.92,16.42 37.24,20.74 38,20.74 MICROSD.3 | 32.92,16.42 v29.87,13.37 | v39.27,10.32 33.17,16.42 32.92,16.42
N$1
  Top 0.254: J1.3 1.68,47.92 1.68,53.25 J1.6
N$2  (via drill 0.33)
  Top 0.254: X3.P$1 12.85,35.22 15.39,32.68 16.16,32.68 C7.1 16.41,32.68 v19.46,32.68 | v18.7,23.79 18.7,22.77 19.2,22.26 19.97,22.26 IC3.16
  Bottom 0.254: v18.7,23.79 19.46,24.55 v19.46,32.68
N$3  (via drill 0.33)
  Top 0.254: C6.1 9.3,34.45 12.6,31.15 X3.P$2 12.85,31.41 17.17,31.41 17.43,31.66 18.95,31.66 19.2,31.91 v20.22,31.91 | v21.74,23.02 20.22,23.02 IC3.17
  Bottom 0.254: v21.74,23.02 21.74,26.33 20.22,27.85 v20.22,31.91
N$4
  Top 0.254: T2.1 16.16,49.19 17.17,50.2 17.43,50.2 17.68,50.46 17.68,50.96 18.7,51.98 20.47,51.98 21.49,50.96 NKA.7
N$5
  Top 0.254: CHARGE.C 18.19,5.75 18.19,6.51 18.95,7.28 18.95,8.8 19.71,9.56 19.71,10.32 IC2.1
N$6  (via drill 0.33)
  Top 0.254: v20.98,7.78 19.97,7.78 IC2.5 | v31.65,10.83 32.67,10.83 33.17,11.34 RC.2
  Bottom 0.254: v20.98,7.78 25.81,7.78 27.59,9.56 30.38,9.56 v31.65,10.83
N$7  (via drill 0.33)
  Top 0.254: v34.7,13.63 37.49,13.63 39.02,12.1 39.02,11.59 Q4.3 | v31.4,13.63 29.87,15.15 U$1.-
  Bottom 0.254: v31.4,13.63 v34.7,13.63
N$8
  Top 0.254: T1.1 5.74,42.33 5.74,43.6 8.03,45.88 8.03,51.73 9.04,52.74 22,52.74 24.03,50.71 NKA.6
N$9  (via drill 0.33)
  Top 0.254: IR3.C 33.17,31.15 33.94,30.39 35.21,30.39 35.97,31.15 IR4.C 36.22,31.41 36.73,31.91 v36.73,35.22 | IR1.C 33.17,40.3 33.94,39.53 34.95,39.53 35.71,40.3 IR2.C 35.97,40.3 v36.98,39.28 | v40.29,26.33 40.29,25.56 36.73,22.01 36.73,15.91 Q1.3
  Bottom 0.254: v40.29,26.33 40.29,33.18 37.49,35.98 | 37.49,35.98 36.98,36.49 v36.98,39.28 | 37.49,35.98 v36.73,35.22
N$10  (via drill 0.33)
  Top 0.254: v21.49,5.75 20.22,5.75 CHARGE.A | v8.03,12.86 12.09,12.86 RE1.1
  Bottom 0.254: v21.49,5.75 10.06,5.75 6,9.82 6,10.83 v8.03,12.86
N$11  (via drill 0.33)
  Top 0.254: IR1.A 33.17,42.07 33.43,42.07 34.7,43.34 v34.7,43.85 | v39.52,47.41 40.79,46.14 RE3.1
  Bottom 0.254: v34.7,43.85 35.97,43.85 v39.52,47.41
N$13  (via drill 0.33)
  Top 0.254: v35.71,41.82 34.44,40.55 IR2.A | v40.54,42.33 40.54,43.6 RE2.1
  Bottom 0.254: v35.71,41.82 40.03,41.82 v40.54,42.33
N$14  (via drill 0.33)
  Top 0.254: v30.38,24.55 29.11,24.55 WS6.O | v36.22,37.76 38,37.76 WS7.I
  Bottom 0.254: v30.38,24.55 30.38,25.82 36.48,31.91 36.48,33.18 35.46,34.2 35.46,36.99 v36.22,37.76
N$15
  Top 0.254: IR3.A 31.65,31.15 32.92,29.88 36.98,29.88 38.76,28.1 RE4.1
N$16  (via drill 0.33)
  Top 0.254: v38.25,39.03 38.25,40.8 WS7.S | v39.78,35.22 39.27,35.22 38.25,34.2 WS8.S
  Bottom 0.254: v38.25,39.03 38.25,36.74 v39.78,35.22
N$17  (via drill 0.33)
  Top 0.254: v35.71,32.42 34.7,31.41 IR4.A | RE5.1 v24.54,24.8
  Bottom 0.254: v35.71,32.42 32.16,32.42 v24.54,24.8
N$20  (via drill 0.33)
  Top 0.254: v33.68,26.83 28.35,26.83 27.08,28.1 25.81,28.1 WS6.I | v34.95,25.56 35.97,24.55 WS5.O
  Bottom 0.254: v34.95,25.56 v33.68,26.83
N$21  (via drill 0.33)
  Top 0.254: v12.35,14.9 12.85,15.4 12.85,16.93 IC3.4 | v13.87,11.85 14.89,11.85 15.39,11.34 RD+1.2
  Bottom 0.254: v12.35,14.9 12.35,13.37 v13.87,11.85
N$22  (via drill 0.33)
  Top 0.254: v10.82,9.05 10.82,7.53 11.58,6.77 11.84,6.77 12.35,6.26 RD-1.2 | v10.82,15.15 11.84,16.17 11.84,16.93 IC3.3
  Bottom 0.254: v10.82,15.15 v10.82,9.05
N$23
  Top 0.254: WS2.I 19.2,37.5 19.71,37.5 23.01,34.2 WS1.O
N$24
  Top 0.254: WS3.I 23.27,45.38 23.27,41.31 WS2.O
N$25
  Top 0.254: WS3.O 28.6,43.34 32.67,47.41 WS4.I
N$28  (via drill 0.33)
  Top 0.254: v40.54,34.2 39.52,33.18 37.75,33.18 37.49,32.93 37.49,31.91 38,31.41 38,30.9 WS8.I | v41.05,39.28 41.05,39.79 42.06,40.8 WS7.O
  Bottom 0.254: v40.54,34.2 40.54,38.77 v41.05,39.28
RESET  (via drill 0.33)
  Top 0.254: IC3.13 20.22,19.72 20.98,19.72 22.76,21.5 R-BTN.B 23.01,21.5 29.62,21.5 R-BTN.B' 29.87,21.75 v31.14,23.02 | v38.76,31.91 43.33,31.91 44.35,30.9 44.35,24.55 43.84,24.04 43.84,8.04 ISP.5
  Bottom 0.254: v38.76,31.91 37.49,31.91 31.14,25.56 v31.14,23.02
RXD  (via drill 0.33)
  Top 0.254: v18.7,25.31 19.97,25.31 IC3.20 | v24.03,11.34 24.54,11.34 26.57,9.31 v26.57,7.28
  Bottom 0.254: v18.7,25.31 18.7,25.06 16.66,23.02 16.66,22.01 16.92,21.75 22.51,21.75 24.03,20.23 v24.03,11.34 | v26.57,7.28 27.08,6.77 30.38,6.77 31.9,5.24 JP1.4
SCK  (via drill 0.33)
  Top 0.254: v17.43,19.47 16.92,18.96 16.92,17.18 IC3.9 | v24.79,18.96 v21.74,18.96 | v30.38,32.68 v30.38,29.37 | v41.05,22.26 41.05,8.04 ISP.3
  Bottom 0.254: v17.43,19.47 17.93,18.96 v21.74,18.96 | v24.79,18.96 24.79,23.79 v30.38,29.37 | v30.38,32.68 30.38,33.95 36.48,40.04 41.56,40.04 42.83,38.77 42.83,23.79 43.33,23.28 43.33,22.26 43.08,22.01 41.05,22.01 | 41.05,22.01 39.78,22.01 39.02,22.77 38.25,22.77 MICROSD.5 | 41.05,22.01 v41.05,22.26
SCL  (via drill 0.33, 0.6 pad 0.25)
  Top 0.254: 25.8,38.01 25.05,38.01 23.01,40.04 16.41,40.04 15.14,41.31 15.14,42.07 IRL.1 14.89,42.33 14.89,44.87 12.6,47.15 12.6,49.19 RIR3.1 | 25.8,38.01 28.35,38.01 | 28.35,38.01 32.67,38.01 LUXNIR.CLK | v23.52,24.29 23.01,23.79 20.22,23.79 IC3.18 | 28.35,38.01 v28.35,36.23 | v47.91,41.57 51.21,41.57 EEPRM.6 | v25.7,39.09 25.8,38.95 25.8,38.01 | LUXRGB1.2 26.11,33.06 v28.55,33.58 28.51,33.6
  Bottom 0.254: LUXNIR1.CLK 19.97,44.36 17.17,44.36 15.14,42.33 IRL.1 | v23.52,24.29 23.52,25.06 29.63,31.16 29.63,32.97 29.65,36.01 | v28.35,36.23 29.54,35.88 | 29.54,35.88 29.65,36.01 | v47.91,41.57 40.54,41.57 40.03,41.06 34.44,41.06 30.63,37.25 30.63,36.74 29.65,36.01 | LUXRGB2.2 25.88,40.07 25.79,39.98 v25.7,39.09 | v28.55,33.58 28.56,33.62 29.54,35.88
SDA  (via drill 0.33)
  Top 0.254: RIR4.1 9.55,51.22 8.79,50.46 8.54,50.46 8.54,45.88 12.35,42.07 12.35,40.04 IRA.1 | v27.59,30.39 26.82,30.59 26.67,30.62 LUXRGB1.6 | v29.11,36.99 29.62,36.49 32.67,36.49 LUXNIR.DATA | v22.51,24.55 20.22,24.55 IC3.19 | v49.43,40.55 51.21,40.55 EEPRM.5
  Bottom 0.254: IRA.1 12.6,40.04 12.6,41.57 15.9,44.87 17.93,44.87 18.95,45.88 19.97,45.88 LUXNIR1.DATA 20.22,45.88 20.98,46.65 27.59,46.65 31.9,42.33 | 28.35,38.77 28.35,39.53 LUXRGB2.6 | 28.35,38.77 28.35,37.76 | 28.35,37.76 28.35,37.5 27.59,36.74 v27.59,30.39 22.51,25.31 v22.51,24.55 | 28.35,37.76 v29.11,36.99 | v49.43,40.55 49.43,41.31 47.65,43.09 32.67,43.09 31.9,42.33 | 28.35,38.77 31.9,42.33
TXD  (via drill 0.33)
  Top 0.254: v21.49,27.85 21.49,26.58 20.98,26.07 20.22,26.07 IC3.21 | v24.54,28.61 24.54,27.34 26.06,25.82 26.57,25.82 v27.33,25.06 | v24.79,12.1 26.32,10.58 26.32,10.32 27.08,9.56 27.08,8.04 v27.59,7.53
  Bottom 0.254: v21.49,27.85 23.78,27.85 v24.54,28.61 | v27.33,25.06 27.33,24.55 25.55,22.77 25.55,13.63 24.79,12.86 v24.79,12.1 | v27.59,7.53 30.63,7.53 31.65,6.51 33.43,6.51 34.44,5.5 JP1.5
VBAT  (via drill 0.33)
  Top 0.254: J1.2 4.22,47.92 4.22,53.25 J1.5 4.47,53.5 5.23,53.5 6.25,54.52 8.54,54.52 8.79,54.27 48.41,54.27 53.75,48.93 53.75,24.55 | v17.93,9.05 17.93,10.32 IC2.3 | BAT1.P$2 47.91,6.51 v45.62,8.8 53.75,16.93 53.75,24.55 | 53.75,24.55 47.14,24.55 46.13,25.56 46.13,33.69 CN1.1
  Bottom 0.254: v17.93,9.05 26.32,9.05 27.33,10.07 29.62,10.07 31.14,11.59 36.73,11.59 38.76,9.56 39.78,9.56 40.29,10.07 44.35,10.07 v45.62,8.8
VBUS  (via drill 0.33)
  Top 0.254: X2.VBUS 8.79,11.85 10.06,11.85 10.57,11.34 12.09,11.34 RE1.2 12.35,11.09 v14.38,9.05 | IC2.4 17.68,7.53 17.68,7.28 16.92,6.51 16.92,4.99 17.17,4.74 23.78,4.74 24.28,5.24 JP1.1 24.28,5.5 24.28,9.05 23.27,10.07 v22.76,10.07 | v15.39,14.9 15.14,15.15 15.14,16.93 IC3.7 15.14,17.18 15.14,17.94 v15.65,18.45 | v23.27,19.72 v26.82,19.72 30.38,19.72 32.16,17.94 33.17,17.94 C1.1 | v27.84,8.55 27.84,9.56 26.82,10.58 v26.82,15.66
  Bottom 0.254: v15.39,14.9 18.19,12.1 21.24,12.1 22.76,10.58 v22.76,10.07 | v23.27,19.72 23.27,19.21 21.24,17.18 16.92,17.18 v15.65,18.45 | v27.84,8.55 33.43,8.55 36.48,5.5 38.51,5.5 ISP.2 | v26.82,19.72 v26.82,15.66 | v14.38,9.05 16.92,6.51 23.27,6.51 24.28,5.5 JP1.1
VCC  (via drill 0.33)
  Top 0.254: 33.94,25.82 32.67,24.55 WS5.D 32.67,24.29 v32.67,22.52 | 33.94,25.82 34.44,26.33 38.51,26.33 RE4.2 38.76,26.07 42.06,29.37 42.06,30.64 WS8.D | 33.94,25.82 28.35,25.82 28.09,25.56 28.09,24.55 27.84,24.29 25.81,24.29 WS6.D | IC3.14 19.97,20.48 16.41,20.48 14.38,18.45 14.38,17.18 IC3.6 14.38,16.93 v14.38,15.4 | IC3.34 8.79,26.83 9.55,26.83 11.33,25.06 11.33,22.01 9.81,20.48 8.79,20.48 IC3.42 8.54,20.48 3.46,20.48 3.2,20.74 v2.69,20.74 | v20.73,11.34 19.71,12.36 IC4.2 | v16.92,7.78 15.39,7.78 RU1.2 | v10.57,18.71 8.79,18.71 IC3.44 | JP1.2 27.08,5.24 29.62,7.78 U$1.+ 29.62,8.04 29.62,8.55 27.59,10.58 v27.59,16.42 | 23.27,28.61 23.27,30.39 WS1.D 23.18,30.64 24.72,32.19 24.72,35.81 27.28,34.91 | 23.27,28.61 23.27,28.36 RE5.2 23.27,28.61 | v16.92,24.55 16.41,25.06 16.41,26.07 17.43,27.09 17.43,28.61 IC3.24 | v18.7,26.83 18.7,27.09 20.22,28.61 23.27,28.61 | IRP.1 9.81,42.58 9.3,43.09 7.77,43.09 T1.2 7.52,43.09 6.76,42.33 6.76,40.55 9.55,37.76 12.85,37.76 15.14,40.04 | T2.2 14.89,51.22 12.6,51.22 RIR3.2 12.35,51.47 10.31,49.44 9.81,49.44 RIR4.2 9.81,49.19 9.81,45.38 15.14,40.04 | LUXNIR.ADR 34.44,37.25 34.44,36.74 LUXNIR.VDD 34.19,36.49 31.14,33.44 | 31.14,33.44 32.67,33.44 C5.1 | 31.14,33.44 29.54,33.68 | 29.54,33.68 29.5,32.3 LUXRGB1.1 | 29.54,33.68 29.54,34.67 27.54,34.65 27.28,34.91 | 27.28,34.91 25.05,36.99 | 25.05,36.99 24.54,37.5 23.27,37.5 WS2.D 23.01,37.76 22,38.77 16.41,38.77 15.14,40.04 | 25.05,36.99 v25.3,37.25 | v36.48,8.29 34.95,8.29 C3.1 | 46.89,48.68 48.41,48.68 49.43,47.66 THM1.2 | 46.89,48.68 44.6,48.68 C4.1 44.35,48.68 39.52,48.68 35.71,44.87
  Top 0.254: 46.89,48.68 51.21,44.36 EEPRM.8 | WS3.D 25.3,43.09 v26.57,43.09 27.84,41.82 29.1,41.82 32.41,43.34 WS4.D 32.67,43.6 33.17,43.6 34.44,44.87 35.71,44.87 | 38.76,44.87 38.76,45.88 RE3.2 | 38.76,44.87 38.76,43.85 RE2.2 38.76,43.6 39.78,42.58 39.78,39.28 41.3,37.76 42.06,37.76 WS7.D 42.32,37.5 42.83,36.99 v44.35,36.99 | 38.76,44.87 35.71,44.87
  Bottom 0.254: 33.17,22.01 38,22.01 MICROSD.4 38.25,21.75 39.27,21.75 39.52,21.5 43.33,21.5 44.35,22.52 v44.35,36.99 | v32.67,22.52 33.17,22.01 | v20.73,11.34 18.95,11.34 18.19,10.58 | 18.19,10.58 17.17,9.56 17.17,8.55 17.43,8.29 | 17.43,8.29 18.7,7.02 25.05,7.02 26.82,5.24 JP1.2 | 17.43,8.29 v16.92,7.78 | 14.12,15.15 14.63,14.64 14.63,14.13 18.19,10.58 | 14.12,15.15 v10.57,18.71 9.55,19.72 4.22,19.72 3.2,20.74 v2.69,20.74 | 14.12,15.15 v14.38,15.4 | v27.59,16.42 33.17,22.01 | 25.82,37.78 v25.3,37.25 24.28,36.23 C14.1 | 25.82,37.78 26.57,38.52 26.57,39.53 LUXRGB2.1 | 25.82,42.35 22.25,45.88 21.74,45.88 LUXNIR1.VDD | 25.82,37.78 24.47,39.38 25.16,39.87 25.35,40.8 25.54,41.09 25.82,42.35 | v16.92,24.55 17.43,24.55 17.93,25.06 17.93,26.07 v18.7,26.83 | v36.48,8.29 38.25,6.51 48.16,6.51 51.97,10.32 RSD.2 51.72,10.58 51.72,45.38 49.68,47.41 THM1.2 | v26.57,43.09 25.82,42.35
VDD  (via drill 0.33)
  Top 0.254: 7.01,48.93 7.01,53.25 J1.4 | 7.01,48.93 7.01,47.92 J1.1 | v17.43,14.9 17.68,14.64 18.7,14.64 IC4.3 | 7.01,48.93 v4.98,48.93 | v34.44,23.53 35.21,22.77 35.21,21.25 C2.1 | v26.32,22.26 25.05,22.26 24.54,22.77 v22.76,22.77 | v13.62,18.71 v17.43,22.52
  Bottom 0.254: v17.43,14.9 17.43,15.4 13.87,18.96 | 13.87,18.96 12.6,20.23 4.47,20.23 1.17,23.53 1.17,45.12 v4.98,48.93 | v34.44,23.53 32.41,23.53 31.9,23.02 31.9,22.52 31.65,22.26 v26.32,22.26 | v22.76,22.77 22.25,22.26 17.68,22.26 v17.43,22.52 | 13.87,18.96 v13.62,18.71

### Text on the board
tPlace: ****OPEN-LUX**** | REV-J | PUBLICLAB.ORG/WIKI/OPEN-LUX | B3 | - | JST | B2 | B1 | USB
bPlace: publiclab.org/wiki/open-lux | NOKIA 5110 | GND | LED | A0 | A1 | A2 | GND | A3 | VCC | MISO | SCK | VBUS | MOSI | VCC | TX | D6 | RST | VBUS | GND | RX | GND